# Altium schematic sheet Main_cct..SchDoc
size A2
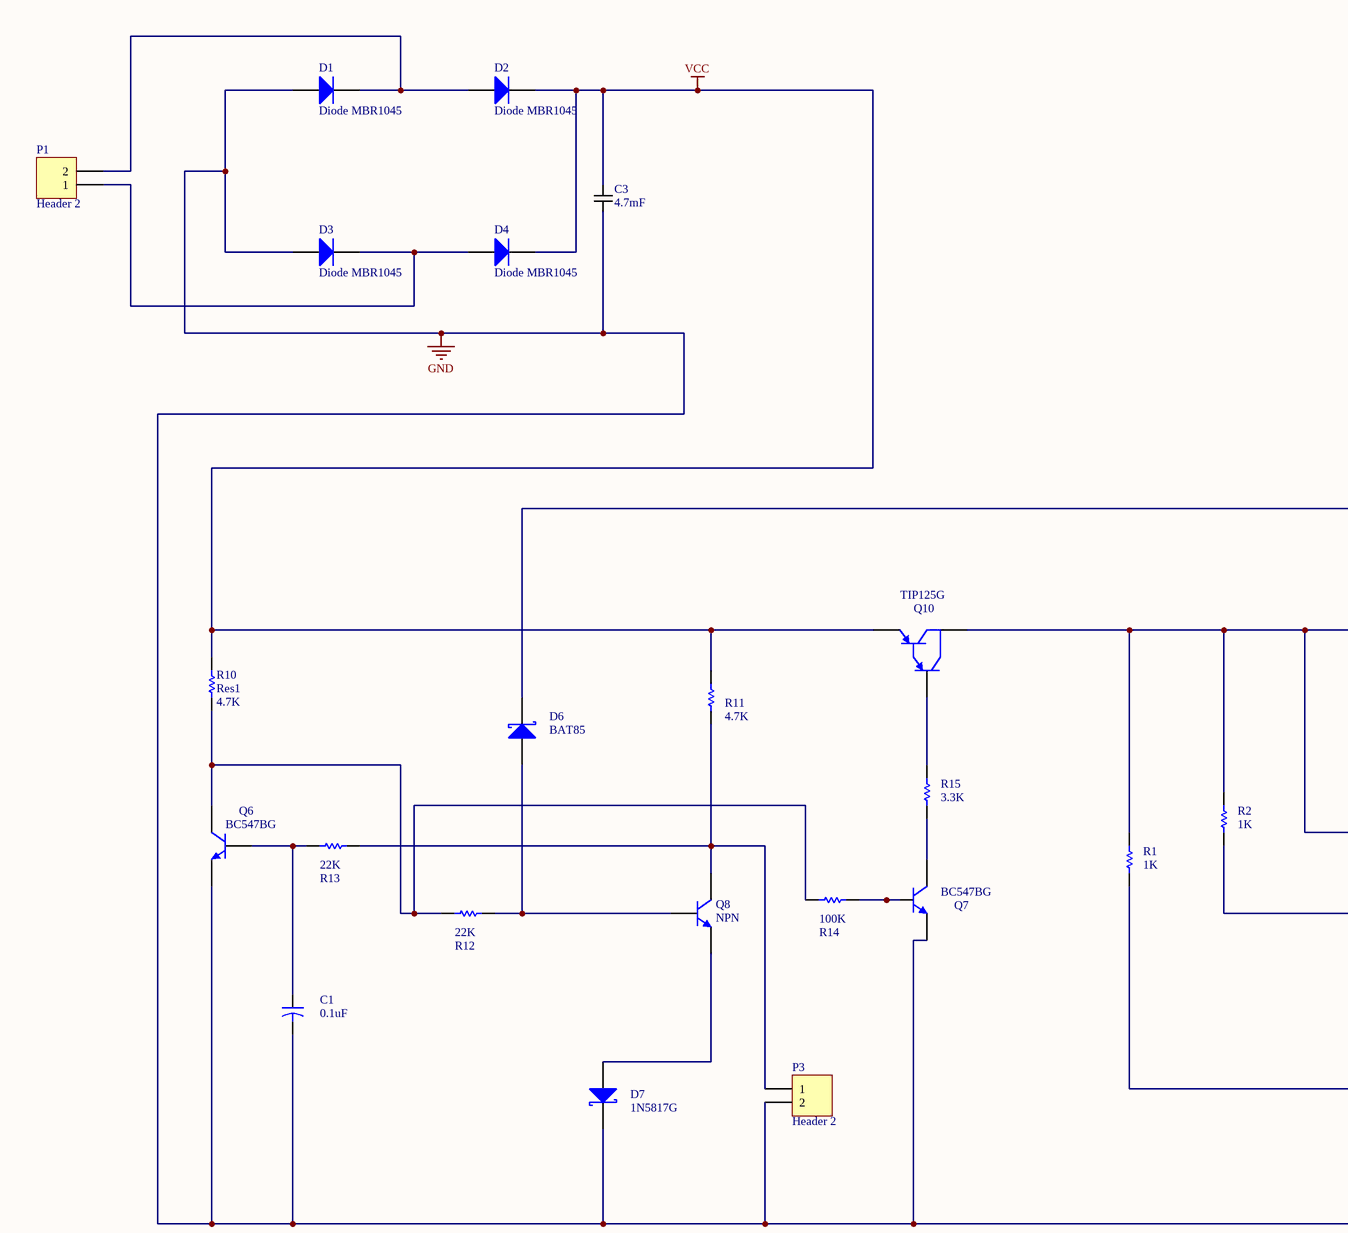
[diagram p0: Main_cct..SchDoc, left]
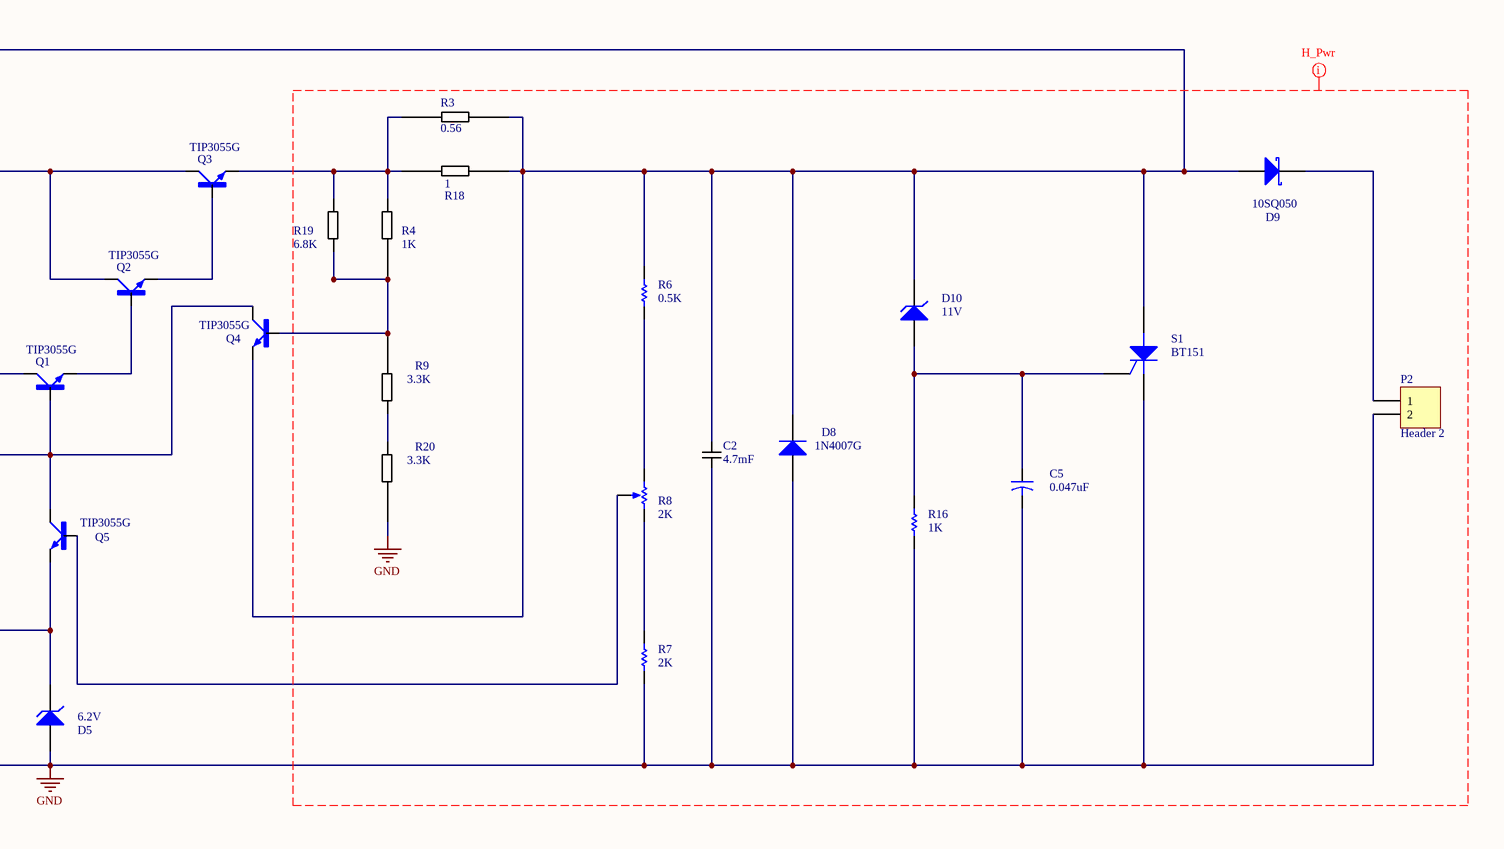
[diagram p1: Main_cct..SchDoc, right]

## Parts
C1  value 0.1uF  [CAPR5-4X5]
C2  4.7mF  [capacitor D 35mm]
C3  4.7mF  [capacitor D 35mm]
C5  value 0.047uF  [CAPR5-4X5]
D1  Diode MBR1045  [DO-201AD]
D2  Diode MBR1045  [DO-201AD]
D3  Diode MBR1045  [DO-201AD]
D4  Diode MBR1045  [DO-201AD]
D5  6.2V  [DIODE-0.7]
D6  BAT85  [DO-204AL]
D7  1N5817G  [DO-204AL]
D8  1N4007G  [DO-201AD]
D9  10SQ050  [resistor 25mm]
D10  11V  [DIODE-0.7]
P1  Header 2  [HDR1X2]
P2  Header 2  [HDR1X2]
P3  Header 2  [HDR1X2]
Q1  TIP3055G  [TOP3AV]
Q2  TIP3055G  [TOP3AV]
Q3  TIP3055G  [TOP3AV]
Q4  TIP3055G  [TOP3AV]
Q5  TIP3055G  [TOP3AV]
Q6  BC547BG  [TO-262-AA]
Q7  BC547BG  [TO-262-AA]
Q8  NPN  [TO-262-AA]
Q10  TIP125G  [E3]
R1  value 1K  [AXIAL-0.3]
R2  value 1K  [AXIAL-0.3]
R3  0.56  [resistor 25mm]
R4  1K  [resistor 25mm]
R6  value 0.5K  [AXIAL-0.3]
R7  value 2K  [AXIAL-0.3]
R8  value 2K  [VR5]
R9  3.3K  [resistor 25mm]
R10  Res1  value 4.7K  [AXIAL-0.3]
R11  value 4.7K  [AXIAL-0.3]
R12  value 22K  [AXIAL-0.3]
R13  value 22K  [AXIAL-0.3]
R14  value 100K  [AXIAL-0.3]
R15  value 3.3K  [AXIAL-0.3]
R16  value 1K  [AXIAL-0.3]
R18  1  [resistor 25mm]
R19  6.8K  [resistor 25mm]
R20  3.3K  [resistor 25mm]
S1  BT151  [TO-220-AB]

## Nets
GND: C1.2 C2.2 C3.2 C5.2 D1.1(A) D3.1(A) D5.1(A) D7.2(K) D8.1(A) P2.2 P3.2 Q6.3(E) Q7.3(E) R7.1 R16.1 R20.1 S1.3(K)
VCC: C3.1 D2.2(K) D4.2(K) Q10.1(E) R10.2 R11.2
NetC1_1: C1.1 Q6.2(B) R13.2
NetC2_1: C2.1 D6.2(K) D8.2(K) D9.1(A) D10.2(K) Q4.E R3.2 R6.2 R18.2 S1.1(A)
NetC5_1: C5.1 D10.1(A) R16.2 S1.2(G)
NetD1_2: D1.2(K) D2.1(A) P1.2
NetD3_2: D3.2(K) D4.1(A) P1.1
NetD5_2: D5.2(K) Q5.E R1.1
NetD6_1: D6.1(A) Q8.2(B) R12.1
NetD7_1: D7.1(A) Q8.3(E)
NetD9_2: D9.2(K) P2.1
NetP3_1: P3.1 Q8.1(C) R11.1 R13.1
NetQ1_B: Q1.B Q4.C Q5.C R2.1
NetQ1_C: Q1.C Q2.C Q3.C Q10.3(C) R1.2 R2.2
NetQ1_E: Q1.E Q2.B
NetQ2_E: Q2.E Q3.B
NetQ3_E: Q3.E R3.1 R4.2 R18.1 R19.2
NetQ4_B: Q4.B R4.1 R9.2 R19.1
NetQ5_B: Q5.B R8.3(TAP)
NetQ6_1: Q6.1(C) R10.1 R12.2 R14.2
NetQ7_1: Q7.1(C) R15.1
NetQ7_2: Q7.2(B) R14.1
NetQ10_2: Q10.2(B) R15.2
NetR6_1: R6.1 R8.1(TOP)
NetR7_2: R7.2 R8.2(BOT)
NetR9_1: R9.1 R20.2

## Layout directives
net class H_Pwr: GND

## Library data of the parts
C1 C5 = Cap2: Capacitor; Published: 23-Sep-2002; PackageReference: CAPR5-4X5; Publisher: Altium Limited; PackageDescription: Capacitor; 2 Leads
C2 C3 = Component_1: diameter 35mm
D1-D4 D8 = Diode 1N5408: 3 Amp Medium Power Silicon Rectifier Diode; Published: 8-Jun-2000; LatestRevisionDate: 17-Jul-2002; LatestRevisionNote: Re-released for DXP Platform.; DatasheetVersion: Aug-1984; PackageReference: DO-201AD; Publisher: Altium Limited; PackageDescription: Diode, Axial; Body 9.5 x 5.3 mm (LxDia. max), Lead Dia. 1.32 mm (max); ComponentLink1Description: Manufacturer Link; ComponentLink1URL: http://www.irf.com/
D5 = D Zener: Zener Diode; Published: 8-Jun-2000; LatestRevisionDate: 17-Jul-2002; LatestRevisionNote: Re-released for DXP Platform.; PackageReference: DIODE-0.7; Publisher: Altium Limited; PackageDescription: Diode, Thru-Hole; 2 Leads; 0.7 in Pin Spacing
D6 D7 D9 = Diode 11DQ03: Schottky Rectifier; Published: 8-Jun-2000; LatestRevisionDate: 17-Jul-2002; LatestRevisionNote: Re-released for DXP Platform.; DatasheetVersion: Dec-1997; PackageReference: DO-204AL; Publisher: Altium Limited; PackageDescription: Diode, Axial; Body 5.2 x 2.7 mm (LxDia. max), Lead Dia. 0.86 mm (max); Code_JEDEC: DO-204-AL; ComponentLink1Description: Manufacturer Link; ComponentLink1URL: http://www.irf.com/; ComponentLink2Description: Datasheet; ComponentLink2URL: http://www.irf.com/product-info/datasheets/data/11dq03.pdf
D10 = D Zener: 1N4741A; Published: 8-Jun-2000; LatestRevisionDate: 17-Jul-2002; LatestRevisionNote: Re-released for DXP Platform.; PackageReference: DIODE-0.7; Publisher: Altium Limited; PackageDescription: Diode, Thru-Hole; 2 Leads; 0.7 in Pin Spacing
P1-P3 = Header 2: Header, 2-Pin; LatestRevisionDate: 17-Jul-2002; LatestRevisionNote: Re-released for DXP Platform.; Publisher: Altium Limited
Q1-Q5 = TIP3055: Tranzistor bipolar _BJT_ NPN 60V 15A 90W Gura de trecere TO-247-3; MF: ON Semiconductor; Value: *; MP: TIP3055; Package: TO-247-3 Bourns; Availability: Unavailable; Price: None; SnapEDA_Link: https://www.snapeda.com/parts/TIP3055/ON%20Semiconductor/view-part/2756238/?ref=snap
Q6-Q8 = NPN: NPN Bipolar Transistor; Published: 8-Jun-2000; LatestRevisionDate: 17-Jul-2002; LatestRevisionNote: Re-released for DXP Platform.; PackageReference: TO-226-AA; Publisher: Altium Limited; PackageDescription: TO, Flat Index; 3 In-Line, Axial Leads; Body Dia. 4.8mm; Leads 0.55 x 0.51 mm (max); Code_JEDEC: TO-226-AA
Q10 = PNP1: PNP Darlington Bipolar Transistor; Published: 8-Jun-2000; LatestRevisionDate: 17-Jul-2002; LatestRevisionNote: Re-released for DXP Platform.; DatasheetVersion: May-1994; PackageVersion: 1995/1996; PackageReference: E3; Publisher: Altium Limited; PackageDescription: TO, Flat Index; 3 In-Line, Axial Leads; Body Dia. 4.6mm; Lead Dia. 0.5 mm (max); ComponentLink1Description: Manufacturer Link; ComponentLink1URL: http://www.zetex.com/
R1 R2 R6 R7 R10-R16 = Res1: Resistor; Published: 8-Jun-2000; LatestRevisionDate: 17-Jul-2002; LatestRevisionNote: Re-released for DXP Platform.; PackageReference: AXIAL-0.3; Publisher: Altium Limited; PackageDescription: Axial Device, Thru-Hole; 2 Leads; 0.3 in Pin Spacing
R3 R4 R9 R18-R20 = Component_1: 25mm length
R8 = RPot: Potentiometer; Sim Note: Enter the Resistance value and the set point into parameter fields.; Set Position: 0.5; Published: 8-Jun-2000; LatestRevisionDate: 17-Jul-2002; LatestRevisionNote: Re-released for DXP Platform.; PackageReference: VR5; Publisher: Altium Limited; PackageDescription: Variable Resistor, Thru-Hole; 3 Leads
S1 = SCR: Silicon Controlled Rectifier; Published: 8-Jun-2000; LatestRevisionDate: 17-Jul-2002; LatestRevisionNote: Re-released for DXP Platform.; PackageReference: TO-220-AB; Publisher: Altium Limited; Code_JEDEC: TO-220-AB